# Altium schematic sheet MAX3232.SchDoc
size A
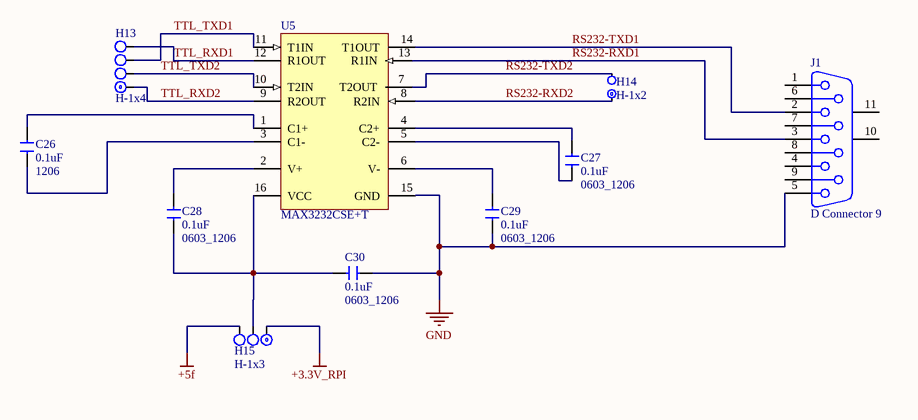
[diagram p0: MAX3232.SchDoc]

## Parts
C26  0.1uF  value 1206  [SMD_CHIP_Cap_Cer_1206]
C27  0.1uF  value 0603_1206  [SMD_CHIP_CAP_CER_0603_TO_1206]
C28  0.1uF  value 0603_1206  [SMD_CHIP_CAP_CER_0603_TO_1206]
C29  0.1uF  value 0603_1206  [SMD_CHIP_CAP_CER_0603_TO_1206]
C30  0.1uF  value 0603_1206  [SMD_CHIP_CAP_CER_0603_TO_1206]
H13  H-1x4  [J1x4]
H14  H-1x2  [J1x2]
H15  H-1x3  [J1x3]
J1  D Connector 9  [DB9-HEMBRA]
U5  MAX3232CSE+T  [MAXM-S16+1_M]

## Nets
+3.3V_RPI: H15.1
+5f: H15.3
GND: C29.2 C30.2 J1.5 U5.15(GND)
RS232-RXD1: J1.3 U5.13(R1IN)
RS232-RXD2: H14.1 U5.8(R2IN)
RS232-TXD1: J1.2 U5.14(T1OUT)
RS232-TXD2: H14.2 U5.7(T2OUT)
TTL_RXD1: H13.4 U5.12(R1OUT)
TTL_RXD2: H13.1 U5.9(R2OUT)
TTL_TXD1: H13.3 U5.11(T1IN)
TTL_TXD2: H13.2 U5.10(T2IN)
NetC26_1: C26.1 U5.1(C1+)
NetC26_2: C26.2 U5.3(C1-)
NetC27_1: C27.1 U5.4(C2+)
NetC27_2: C27.2 U5.5(C2-)
NetC28_1: C28.1 U5.2(V+)
NetC28_2: C28.2 C30.1 H15.2 U5.16(VCC)
NetC29_1: C29.1 U5.6(V-)

Not connected (* = marked no-connect by the designer): J1 1 4 6 7 8 9 10(MH1) 11(MH2)

## Library data of the parts
C26 = SMD_CHIP_CAP_CER_1206
C27-C30 = SMD_CHIP_CAP_CER_0603_TO_1206
J1 = D Connector 9: Receptacle Assembly, 9 Position, Right Angle; PackageDocument: O; Positions: 9; Published: 15-Jun-2001; LatestRevisionDate: 17-Jul-2002; LatestRevisionNote: Re-released for DXP Platform.; DatasheetDocument: 1-Sep-1999; PackageReference: 788750; Publisher: Altium Limited; Orientation: Right Angle; Gender: Receptacle
U5 = CMP-2000-06662-1: Low-Power, True RS-232 Transceivers Using Four 0.1 uF External Capacitor, up to 1 Mbps, 3.0 to 5.5 V, 0 to 70 degC, 16-Pin SOIC (S16+1), RoHS, Tape and Reel; Shutdown: No; Data Rate: 235kbps; Brand: MaximIntegrated; Number of Receivers: 2Receiver; Supply Current: 1mA; Number of Drivers: 2Driver; Operating Supply Voltage: 3Vto5.5V; Number of I/Os: 8; Propagation Delay Time ns: 0.3us; Package Version: Rev. G, 01/2016; Datasheet Version: Rev. 7, 01/2007; Package Description: 16-Pin Small Outline Integrated Circuit, Body 9.9 x 3.9 mm, Pitch 1.27 mm; Package / Case: SO-Narrow-16; Package Reference: S16+1; Package URL: http://pdfserv.maximintegrated.com/package_dwgs/21-0041.PDF; Function: Transceiver; Packaging: Reel; Manufacturer URL: http://www.maximintegrated.com/; Maximum Operating Temperature: +70C; Series: MAX3232; Datasheet URL: https://datasheets.maximintegrated.com/en/ds/MAX3222-MAX3241.pdf; Product Category: RS-232InterfaceIC; Operating Temperature Range: 0Cto+70C; Factory Pack Quantity: 2500; Mounting Style: SMD/SMT; Minimum Operating Temperature: 0C; Manufacturer: MaximIntegrated; Mounting Technology: SurfaceMount; RoHS: Details
H13 = H-1x4: Price: 0.04
H14 = H-1x2: Price: 0.02
H15 = H-1x3: Price: 0.03